# Altium schematic sheet Sheet1.SchDoc
size A4
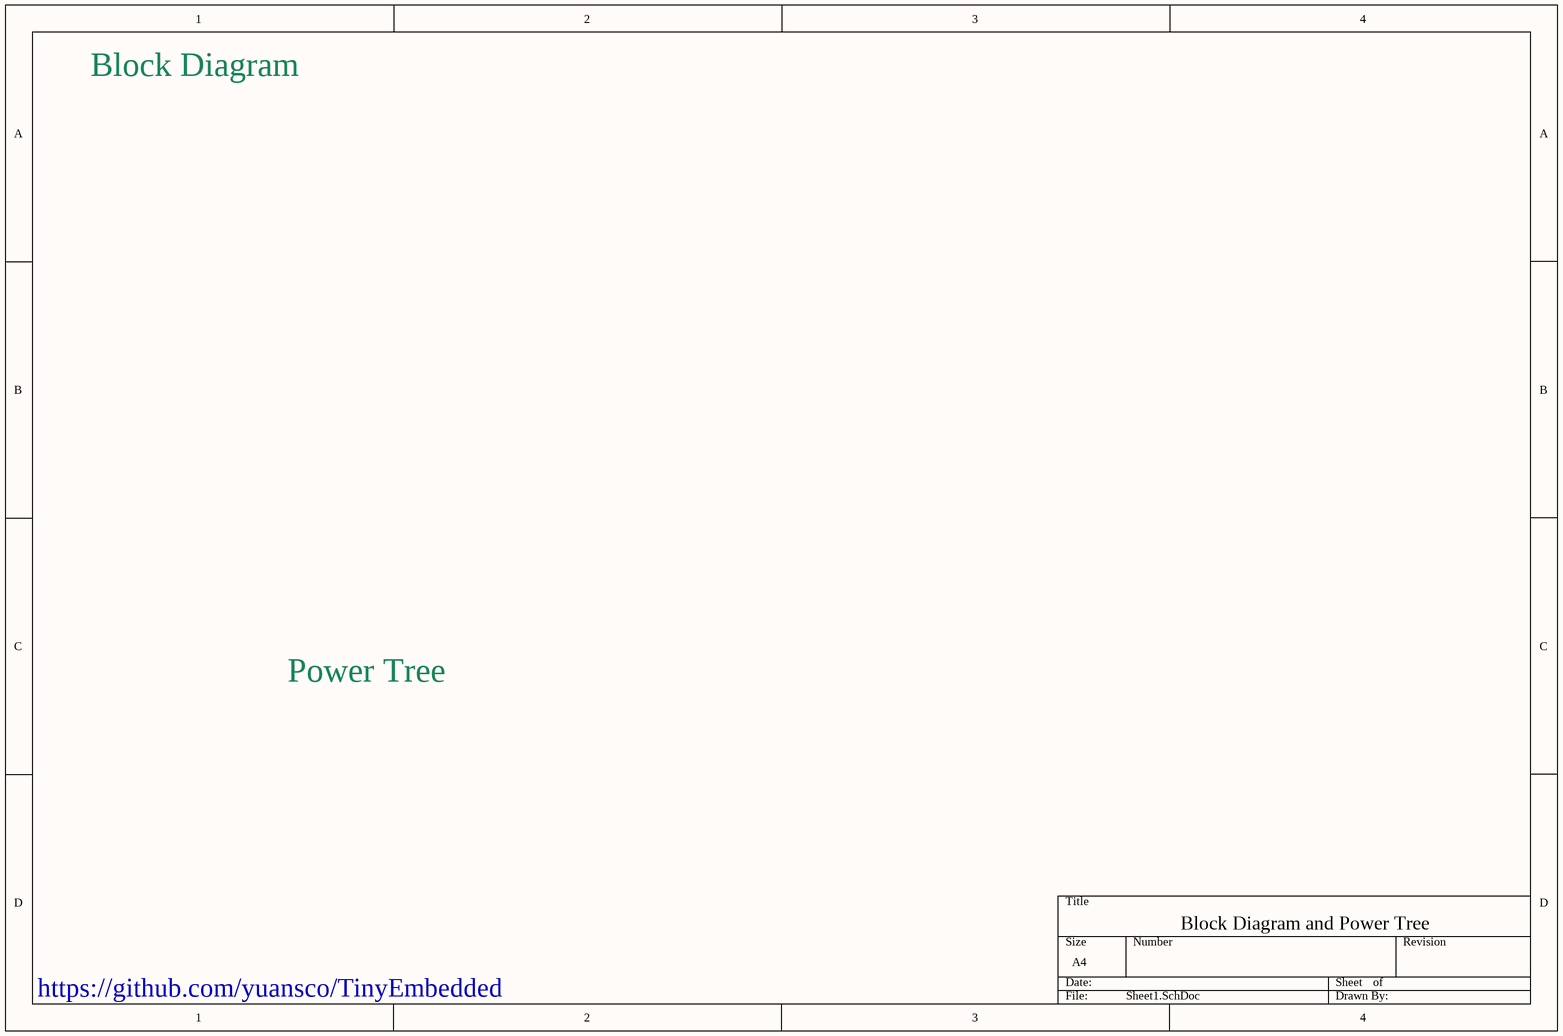
[diagram p0: Sheet1.SchDoc]

## Notes on the sheet
- Block Diagram
- Power Tree
- Block Diagram and Power Tree
- https://github.com/yuansco/TinyEmbedded